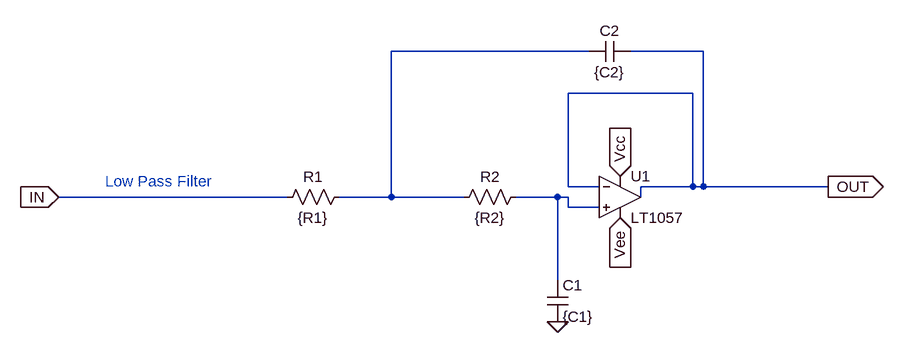
[diagram p0: schematic working_analog.asc]
working_analog.asc, the LTspice schematic file:
Version 4.1
SHEET 1 1336 680
WIRE -400 -64 -704 -64
WIRE -224 -64 -336 -64
WIRE -240 0 -432 0
WIRE -432 144 -432 0
WIRE -384 144 -432 144
WIRE -240 144 -240 0
WIRE -240 144 -320 144
WIRE -224 144 -224 -64
WIRE -224 144 -240 144
WIRE -32 144 -224 144
WIRE -864 160 -1216 160
WIRE -704 160 -704 -64
WIRE -704 160 -784 160
WIRE -592 160 -704 160
WIRE -448 160 -512 160
WIRE -432 160 -448 160
WIRE -320 160 -320 144
WIRE -432 176 -432 160
WIRE -384 176 -432 176
WIRE -448 288 -448 160
FLAG -448 352 0
FLAG -1216 160 IN
IOPIN -1216 160 In
FLAG -32 144 OUT
IOPIN -32 144 Out
FLAG -352 128 Vcc
IOPIN -352 128 In
FLAG -352 192 Vee
IOPIN -352 192 In
SYMBOL res -768 144 R90
WINDOW 0 0 56 VBottom 2
WINDOW 3 32 56 VTop 2
SYMATTR InstName R1
SYMATTR Value {R1}
SYMBOL cap -464 288 R0
SYMATTR InstName C1
SYMATTR Value {C1}
SYMBOL res -496 144 R90
WINDOW 0 0 56 VBottom 2
WINDOW 3 32 56 VTop 2
SYMATTR InstName R2
SYMATTR Value {R2}
SYMBOL cap -336 -80 R90
WINDOW 0 0 32 VBottom 2
WINDOW 3 32 32 VTop 2
SYMATTR InstName C2
SYMATTR Value {C2}
SYMBOL OpAmps\\LT1057 -352 96 R0
SYMATTR InstName U1
TEXT -1144 136 Left 2 ;Low Pass Filter

The netlist it stands for:
* working_analog.asc
R1 N001 IN {R1}
C1 N002 0 {C1}
R2 N002 N001 {R2}
C2 OUT N001 {C2}
X§U1 N002 OUT Vcc Vee OUT LT1057  ; pins In+ In- V+ V- OUT
* Low Pass Filter
.lib LTC.lib
.backanno
.end